# Altium schematic sheet INPUT_PROTECTION.SchDoc
size A4; SheetNumber: 10; SheetTotal: 13
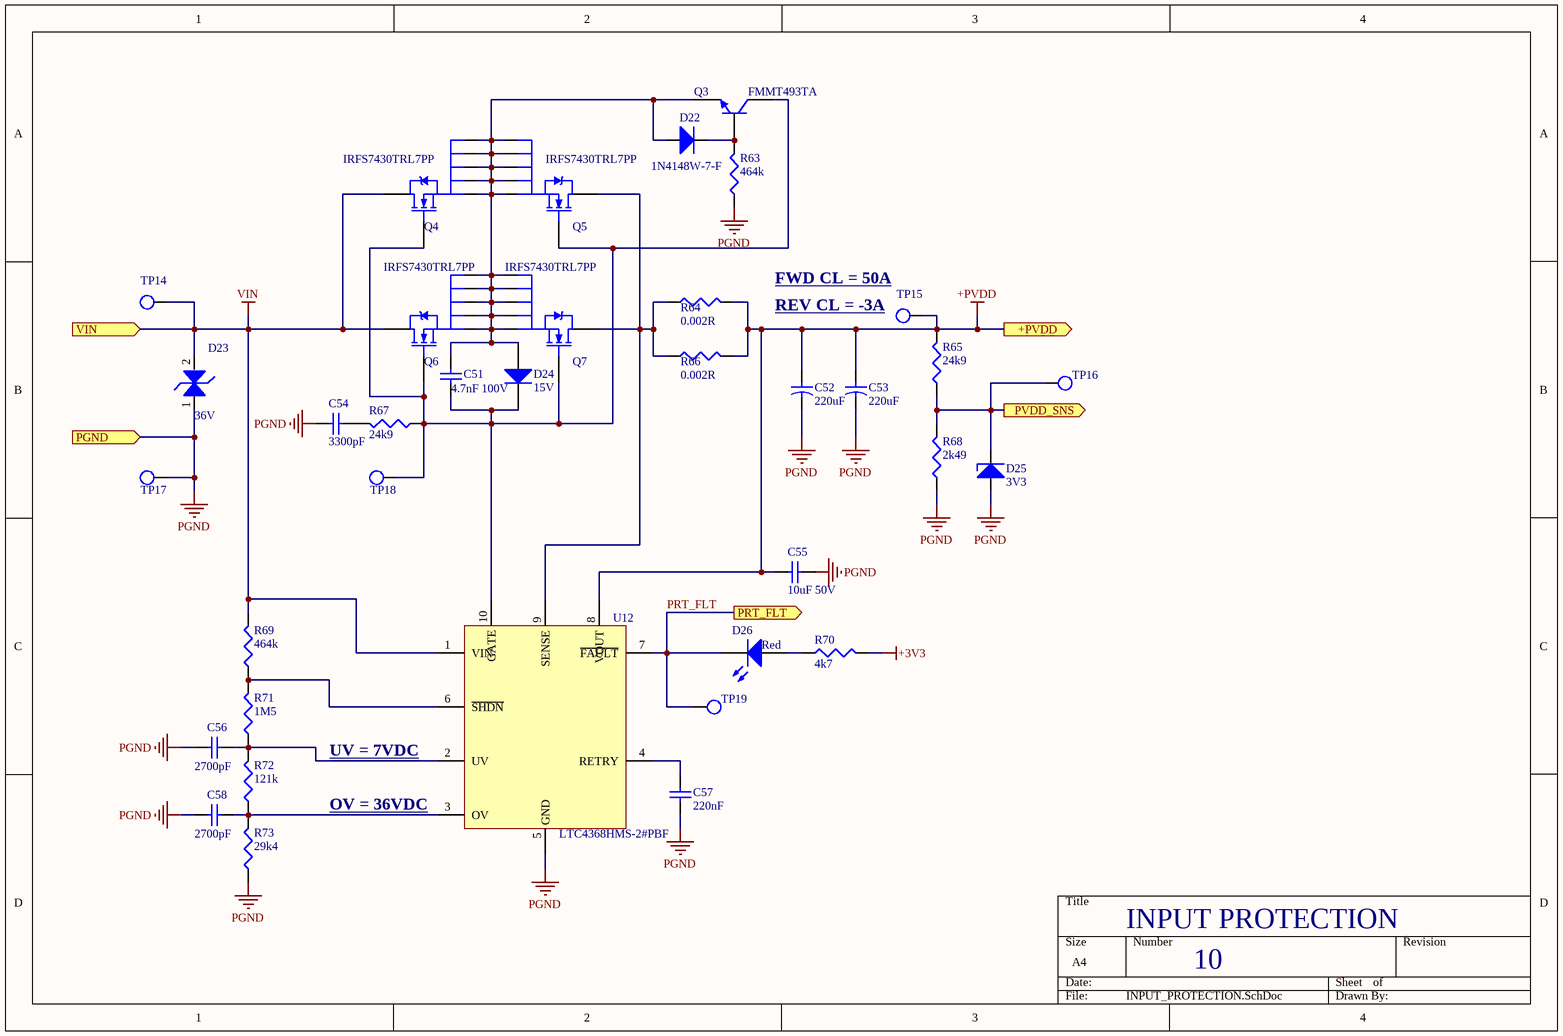
[diagram p0: INPUT_PROTECTION.SchDoc]

## Parts
C51  4.7nF 100V  [CAP1206]
C52  220uF  [CAP_RADIAL_SMD_10x10]
C53  220uF  [CAP_RADIAL_SMD_10x10]
C54  3300pF  [CAP0805]
C55  10uF 50V  [CAP1206]
C56  2700pF  [CAP0603]
C57  220nF  [CAP0603]
C58  2700pF  [CAP0603]
D22  P/N: 1N4148W-7-F  [SOD123_1N4148W-7-F]  (hidden comment: 100V 300mA)
D23  36V  [DO214AA]
D24  15V  [SOD128_PMEG10030ELPX]
D25  3V3  [SOD323]
D26  Red  [LED0603]
Q3  P/N: FMMT493TA  [SOT23_FMMT493TA]  (hidden comment: 100V 1A)
Q4  P/N: IRFS7430TRL7PP  [TO263-7_INFINEON]  (hidden comment: NMOS)
Q5  P/N: IRFS7430TRL7PP  [TO263-7_INFINEON]  (hidden comment: NMOS)
Q6  P/N: IRFS7430TRL7PP  [TO263-7_INFINEON]  (hidden comment: NMOS)
Q7  P/N: IRFS7430TRL7PP  [TO263-7_INFINEON]  (hidden comment: NMOS)
R63  464k  [RES0603]
R64  0.002R  [RES2512_WSLF_SERIES]
R65  24k9  [RES0603]
R66  0.002R  [RES2512_WSLF_SERIES]
R67  24k9  [RES0603]
R68  2k49  [RES0603]
R69  464k  [RES0603]
R70  4k7  [RES0603]
R71  1M5  [RES0603]
R72  121k  [RES0603]
R73  29k4  [RES0603]
TP14  TEST_POINT  [TEST_POINT_TH]  (value not drawn)  (no BOM)
TP15  TEST_POINT  [TEST_POINT_TH]  (value not drawn)  (no BOM)
TP16  TEST_POINT  [TEST_POINT_TH]  (value not drawn)  (no BOM)
TP17  TEST_POINT  [TEST_POINT_TH]  (value not drawn)  (no BOM)
TP18  TEST_POINT  [TEST_POINT_TH]  (value not drawn)  (no BOM)
TP19  TEST_POINT  [TEST_POINT_TH]  (value not drawn)  (no BOM)
U12  ADJ  [MSOP10]  (value not drawn)

## Ports
+PVDD (out), PGND (in), PRT_FLT (out), PVDD_SNS (out), VIN (in)

## Nets
+3V3: R70.2
+PVDD: C52.1 C53.1 C55.2 R64.2 R65.2 R66.2 TP15.1 U12.8(VOUT) ; port +PVDD
PGND: C52.2 C53.2 C54.1 C55.1 C56.1 C57.1 C58.1 D23.1 D25.2(A) R63.1 R68.1 R73.1 TP17.1 U12.5(GND) ; port PGND
VIN: D23.2 Q4.8(D) Q6.8(D) R69.2 TP14.1 U12.1(VIN) ; port VIN
PRT_FLT: D26.2(K) TP19.1 U12.7(~{FAULT}) ; port PRT_FLT
PVDD_SNS: D25.1(K) R65.1 R68.2 TP16.1 ; port PVDD_SNS
NetC51_1: C51.1 D24.2(K) Q3.3(C) Q4.1(G) Q5.1(G) Q6.1(G) Q7.1(G) R67.1 TP18.1 U12.10(GATE)
NetC51_2: C51.2 D22.1(A) D24.1(A) Q3.1(E) Q4.2(S) Q4.3(S) Q4.5(S) Q4.6(S) Q4.7(S) Q5.2(S) Q5.3(S) Q5.5(S) Q5.6(S) Q5.7(S) Q6.2(S) Q6.3(S) Q6.5(S) Q6.6(S) Q6.7(S) Q7.2(S) Q7.3(S) Q7.5(S) Q7.6(S) Q7.7(S)
NetC54_2: C54.2 R67.2
NetC56_2: C56.2 R71.1 R72.2 U12.2(UV)
NetC57_2: C57.2 U12.4(RETRY)
NetC58_2: C58.2 R72.1 R73.2 U12.3(OV)
NetD22_2: D22.2(K) Q3.2(B) R63.2
NetD26_1: D26.1(A) R70.1
NetQ5_8: Q5.8(D) Q7.8(D) R64.1 R66.1 U12.9(SENSE)
NetR69_1: R69.1 R71.2 U12.6(~{SHDN})

## Notes on the sheet
- FWD CL = 50A
- (near TP15) REV CL = -3A
- UV = 7VDC
- (near U12) OV = 36VDC
- INPUT PROTECTION

## Library data of the parts
C51 = CAP1206_4.7nF_100V: CAP CER 4700PF 100V X7R 1206; P/N: CC1206KRX7R0BB472; Order Code: DIGI : 311-4480-1-ND; Value: 4.7nF 100V
C52 C53 = CAP_RADIAL_EEE-FK1H221GP: CAP ALUM 220UF 20% 50V SMD; Value: 220uF 50V; Order Code: DIGI : PCE4324CT-ND; P/N: EEE-FK1H221GP
C54 = CAP0805_3300pF: CAP CER 3300PF 100V X7R 0805; P/N: CGA4F2X7R2A332M085AA; Order Code: DIGI : 445-12724-1-ND; Value: 3300pF
C55 = CAP1206_10uF: CAP CER 10UF 50V X7R 1206; P/N: CL31B106KBHNNNE; Order Code: DIGI : 1276-6767-1-ND; Value: 10uF 50V
C56 C58 = CAP0603_2700pF: CAP CER 1200PF 50V X7R 0603; P/N: CL10B272KB8NNNC; Value: 2700pF 50V; Order Code: DIGI : 1276-2022-1-ND
C57 = CAP0603_220n: CAP CER 0.22UF 50V X7R 0603; P/N: CGA3E3X7R1H224K080AB; Value: 220nF 50V; Order Code: DIGI : 445-6926-1-ND
D22 = DIODE_1N4148W-7-F: DIODE GEN PURP 100V 300MA SOD123; Order Code: DIGI : 1N4148W-FDICT-ND; Value: 100V 300mA
D23 = SMBJ36CA-TR_TVS_BI_DIR: TVS DIODE 36V DO214AA; Order Code: DIGI : 497-12053-1-ND; P/N: SMBJ36CA-TR; Value: 36V
D24 = ZNR_DZ2415000L: DIODE ZENER 15V 2W TMINIP2; Value: 15V 2W; Order Code: DIGI : DZ2415000LCT-ND; P/N: DZ2415000L
D25 = ZENER_3V3_MM3Z3V3T1G: DIODE ZENER 3.3V 300MW SOD323; Order Code: DIGI : MM3Z3V3T1GOSCT-ND; P/N: MM3Z3V3T1G; Value: 3V3
D26 = LED0603_RED: LED RED CLEAR 0603 SMD; P/N: 150060RS75000; Order Code: DIGI : 732-4978-1-ND; Value: Red
Q3 = FMMT493TA_NPN: TRANS NPN 100V 1A SOT23-3; Order Code: DIGI : FMMT493CT-ND; Value: 100V 1A
Q4-Q7 = IRFS7430TRL7PP_NMOS: MOSFET N-CH 40V 240A D2PAK; Order Code: DIGI : IRFS7430TRL7PPCT-ND; Value: 40V 240A
R63 R69 = RES0603_464k: RES 464K OHM 1% 1/10W 0603; Order Code: DIGI : RMCF0603FT464KCT-ND; P/N: RMCF0603FT464K; Value: 464k
R64 R66 = RES2512_2mR: RES 0.002 OHM 1% 5W 2512; P/N: CSS2H-2512K-2L00F; Order Code: DIGI : CSS2H-2512K-2L00FCT-ND; Value: 0.002R
R65 R67 = RES0603_24k9: RES SMD 24.9K OHM 1% 1/10W 0603; Order Code: DIGI : P24.9KHCT-ND; P/N: ERJ-3EKF2492V; Value: 24k9
R68 = RES0603_2k49: RES 2.49K OHM 1% 1/10W 0603; Order Code: DIGI : RMCF0603FT2K49CT-ND; P/N: RMCF0603FT2K49; ART Code: ART0014241; Value: 2k49
R70 = RES0603_4k7: RES SMD 4.7K OHM 1% 1/10W 0603; Order Code: DIGI : 311-4.70KHRCT-ND; P/N: RC0603FR-074K7L; Value: 4k7
R71 = RES0603_1M5: RES 1.5M OHM 1% 1/10W 0603; Order Code: DIGI : RMCF0603FT1M50CT-ND; P/N: RMCF0603FT1M50; Value: 1M5
R72 = RES0603_121k: RES 121K OHM 1% 1/10W 0603; Order Code: DIGI : RMCF0603FT121KCT-ND; P/N: RMCF0603FT121K; Value: 121k
R73 = RES0603_29k4: RES SMD 29.4K OHM 1% 1/10W 0603; Order Code: DIGI : 311-29.4KHRCT-ND; P/N: RC0603FR-0729K4L; ART Code: ART0022327; Value: 29k4
U12 = LTC4368HMS-2#PBF: IC SURGE SUPPRESSION ADJ 10MSOP; Order Code: DIGI : LTC4368HMS-2#PBF-ND; Value: ADJ; P/N: LTC4368HMS-2#PBF